# EAGLE schematic defcon2023_v1 (EAGLE 9.6.2)
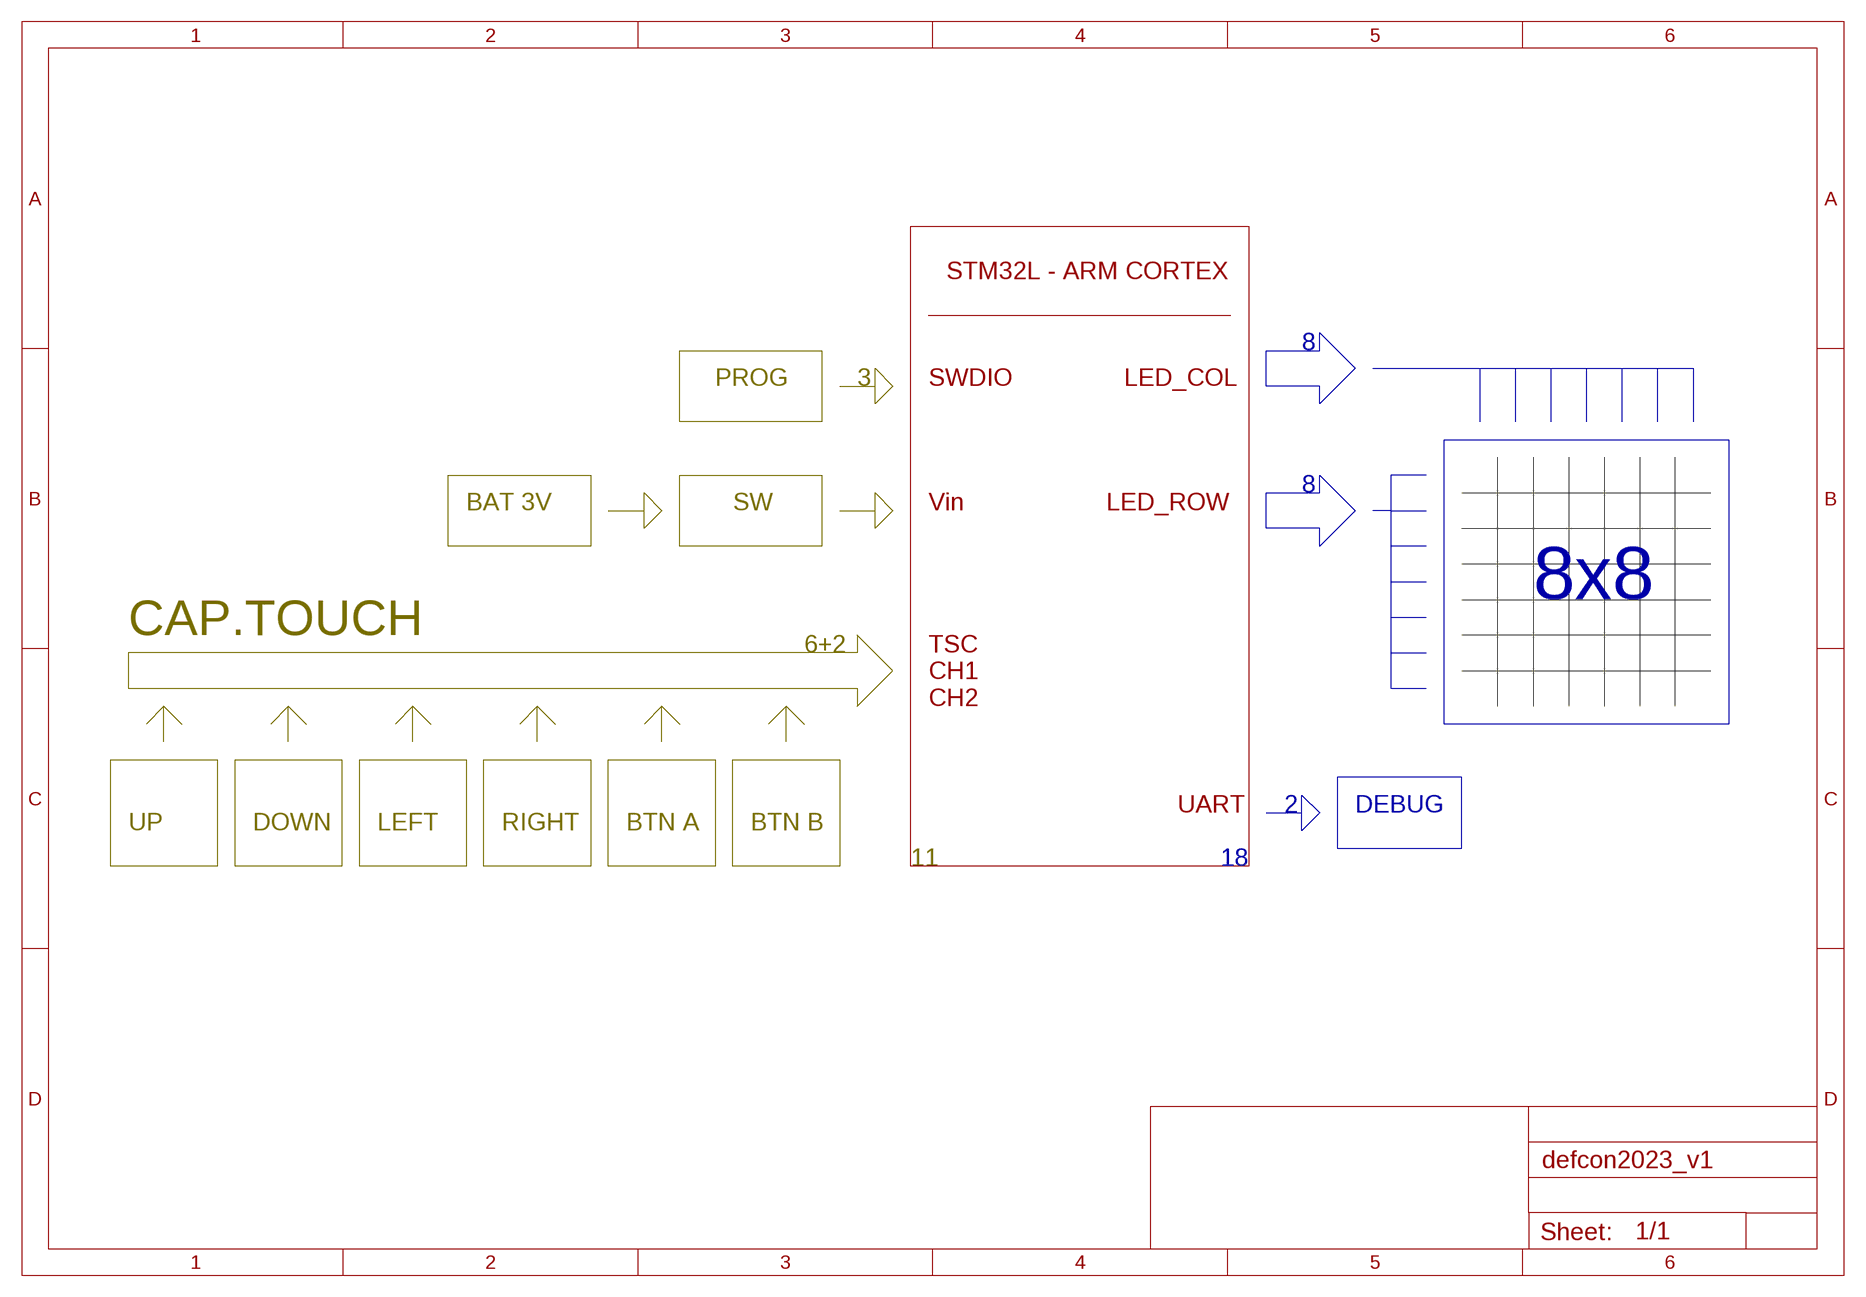
[diagram p0: schematic, sheet 1, part 1 of 2]
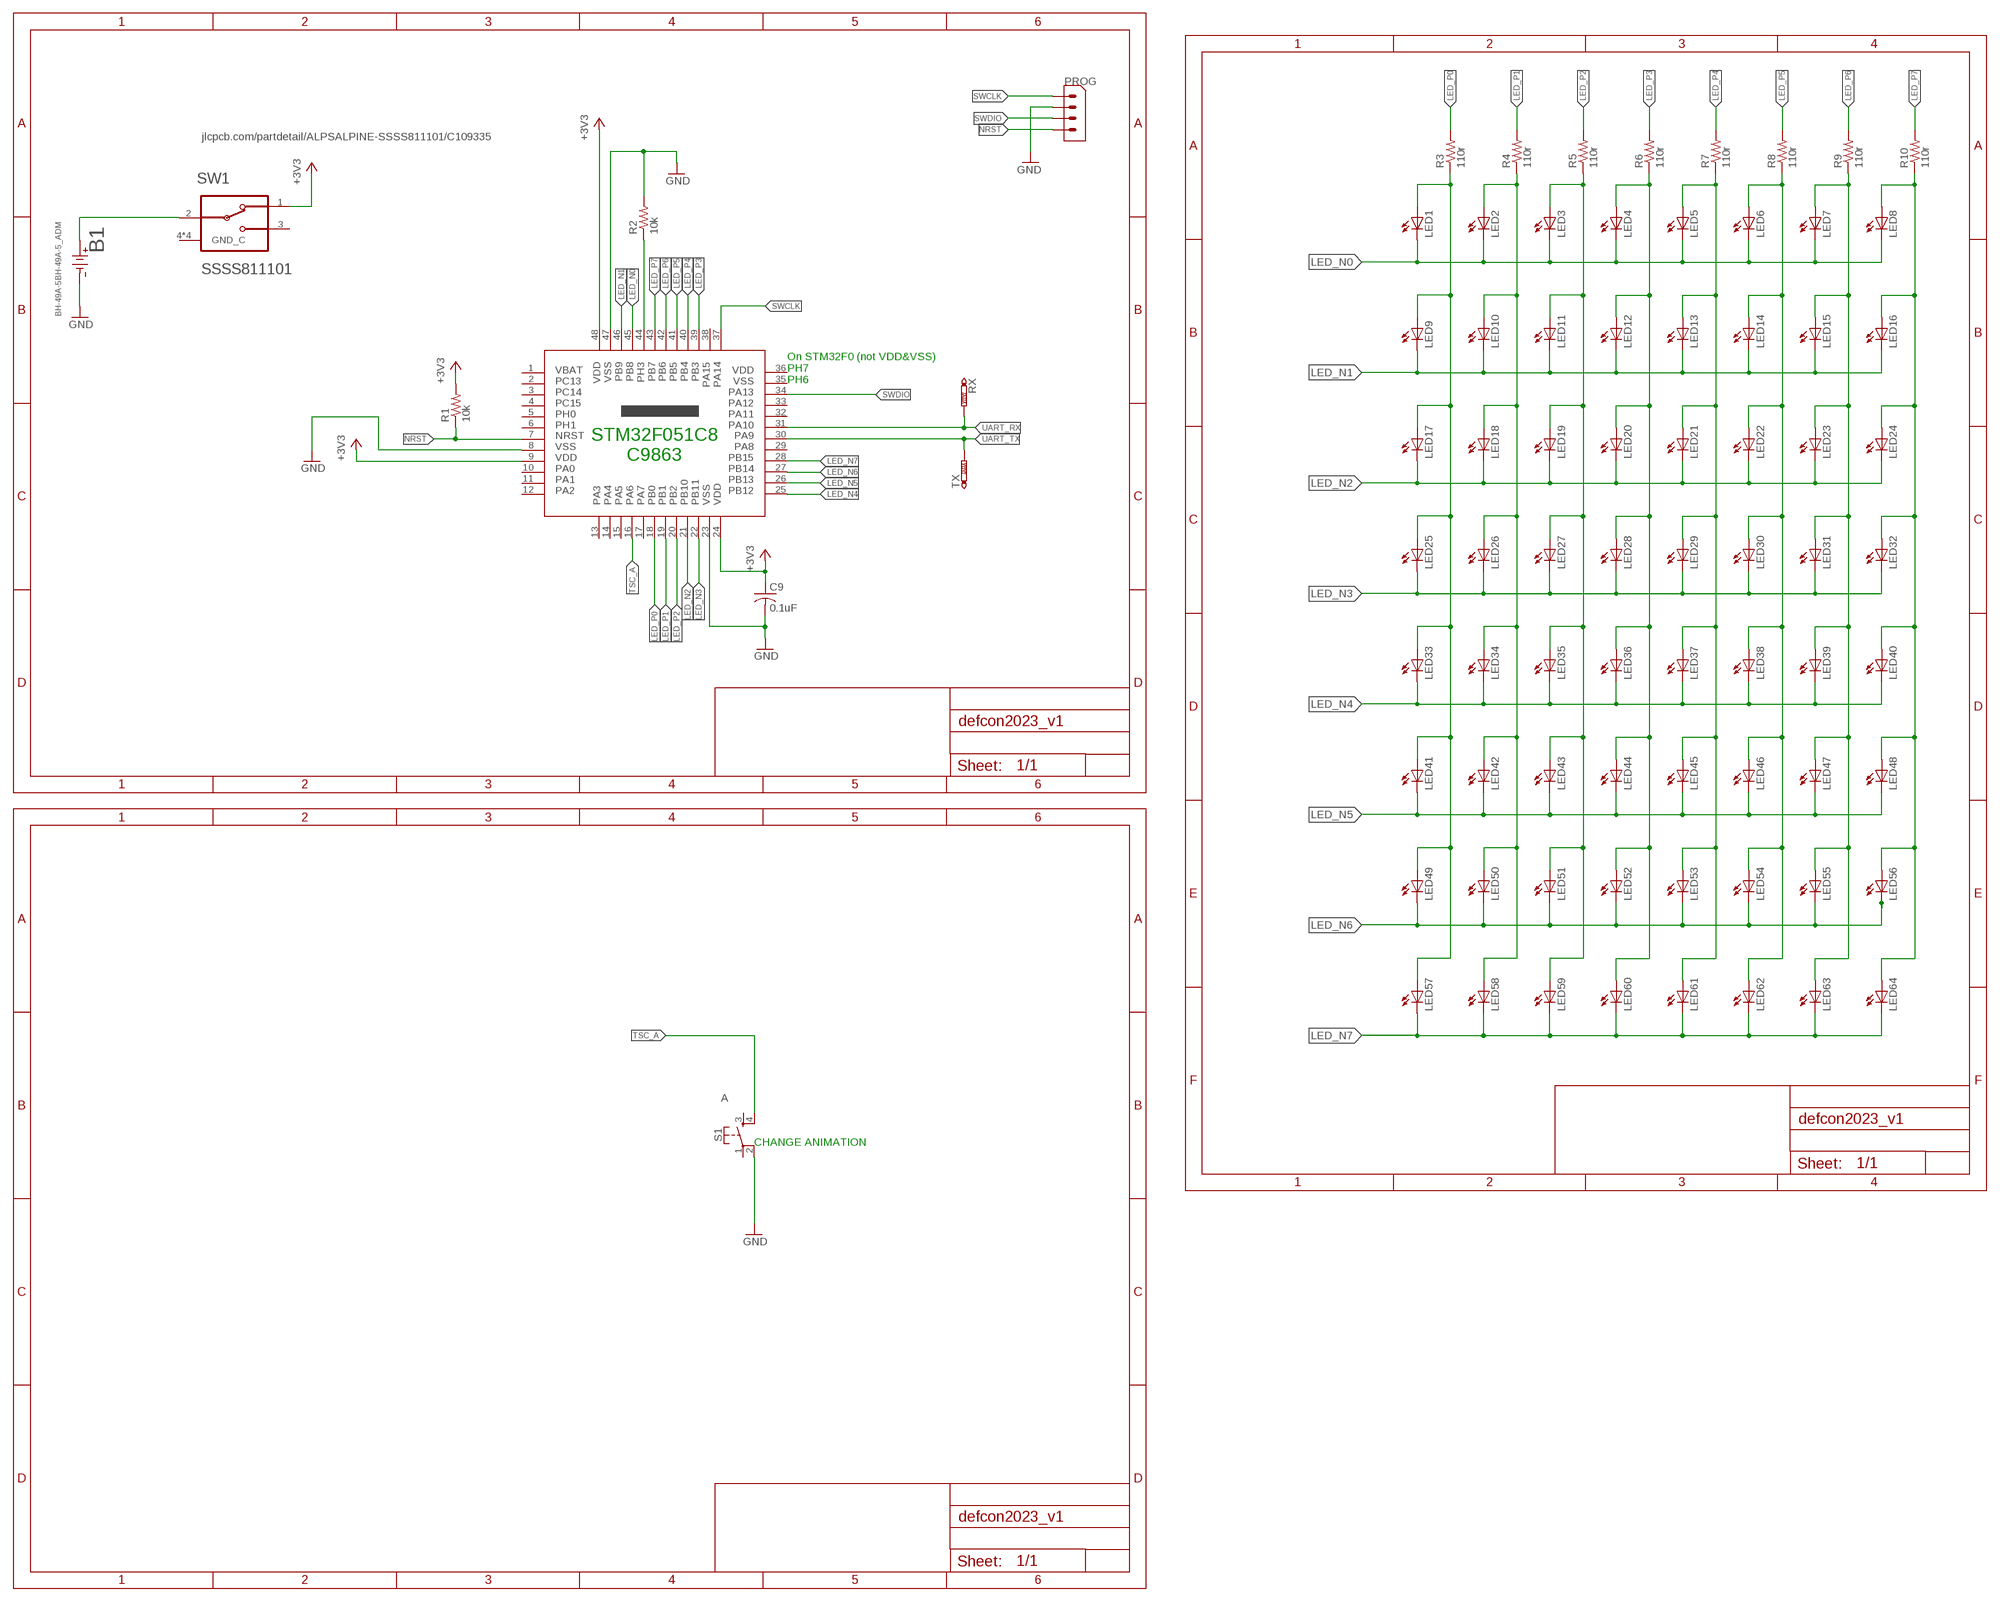
[diagram p1: schematic, sheet 1, part 2 of 2]

## Parts
B1  BH-49A-5BH-49A-5_ADM  [BH-49A-5_ADM]
C9  0.1uF  C-USC0603  [C0603]
LED1  LEDCHIP-LED0603  [CHIP-LED0603]
LED2  LEDCHIP-LED0603  [CHIP-LED0603]
LED3  LEDCHIP-LED0603  [CHIP-LED0603]
LED4  LEDCHIP-LED0603  [CHIP-LED0603]
LED5  LEDCHIP-LED0603  [CHIP-LED0603]
LED6  LEDCHIP-LED0603  [CHIP-LED0603]
LED7  LEDCHIP-LED0603  [CHIP-LED0603]
LED8  LEDCHIP-LED0603  [CHIP-LED0603]
LED9  LEDCHIP-LED0603  [CHIP-LED0603]
LED10  LEDCHIP-LED0603  [CHIP-LED0603]
LED11  LEDCHIP-LED0603  [CHIP-LED0603]
LED12  LEDCHIP-LED0603  [CHIP-LED0603]
LED13  LEDCHIP-LED0603  [CHIP-LED0603]
LED14  LEDCHIP-LED0603  [CHIP-LED0603]
LED15  LEDCHIP-LED0603  [CHIP-LED0603]
LED16  LEDCHIP-LED0603  [CHIP-LED0603]
LED17  LEDCHIP-LED0603  [CHIP-LED0603]
LED18  LEDCHIP-LED0603  [CHIP-LED0603]
LED19  LEDCHIP-LED0603  [CHIP-LED0603]
LED20  LEDCHIP-LED0603  [CHIP-LED0603]
LED21  LEDCHIP-LED0603  [CHIP-LED0603]
LED22  LEDCHIP-LED0603  [CHIP-LED0603]
LED23  LEDCHIP-LED0603  [CHIP-LED0603]
LED24  LEDCHIP-LED0603  [CHIP-LED0603]
LED25  LEDCHIP-LED0603  [CHIP-LED0603]
LED26  LEDCHIP-LED0603  [CHIP-LED0603]
LED27  LEDCHIP-LED0603  [CHIP-LED0603]
LED28  LEDCHIP-LED0603  [CHIP-LED0603]
LED29  LEDCHIP-LED0603  [CHIP-LED0603]
LED30  LEDCHIP-LED0603  [CHIP-LED0603]
LED31  LEDCHIP-LED0603  [CHIP-LED0603]
LED32  LEDCHIP-LED0603  [CHIP-LED0603]
LED33  LEDCHIP-LED0603  [CHIP-LED0603]
LED34  LEDCHIP-LED0603  [CHIP-LED0603]
LED35  LEDCHIP-LED0603  [CHIP-LED0603]
LED36  LEDCHIP-LED0603  [CHIP-LED0603]
LED37  LEDCHIP-LED0603  [CHIP-LED0603]
LED38  LEDCHIP-LED0603  [CHIP-LED0603]
LED39  LEDCHIP-LED0603  [CHIP-LED0603]
LED40  LEDCHIP-LED0603  [CHIP-LED0603]
LED41  LEDCHIP-LED0603  [CHIP-LED0603]
LED42  LEDCHIP-LED0603  [CHIP-LED0603]
LED43  LEDCHIP-LED0603  [CHIP-LED0603]
LED44  LEDCHIP-LED0603  [CHIP-LED0603]
LED45  LEDCHIP-LED0603  [CHIP-LED0603]
LED46  LEDCHIP-LED0603  [CHIP-LED0603]
LED47  LEDCHIP-LED0603  [CHIP-LED0603]
LED48  LEDCHIP-LED0603  [CHIP-LED0603]
LED49  LEDCHIP-LED0603  [CHIP-LED0603]
LED50  LEDCHIP-LED0603  [CHIP-LED0603]
LED51  LEDCHIP-LED0603  [CHIP-LED0603]
LED52  LEDCHIP-LED0603  [CHIP-LED0603]
LED53  LEDCHIP-LED0603  [CHIP-LED0603]
LED54  LEDCHIP-LED0603  [CHIP-LED0603]
LED55  LEDCHIP-LED0603  [CHIP-LED0603]
LED56  LEDCHIP-LED0603  [CHIP-LED0603]
LED57  LEDCHIP-LED0603  [CHIP-LED0603]
LED58  LEDCHIP-LED0603  [CHIP-LED0603]
LED59  LEDCHIP-LED0603  [CHIP-LED0603]
LED60  LEDCHIP-LED0603  [CHIP-LED0603]
LED61  LEDCHIP-LED0603  [CHIP-LED0603]
LED62  LEDCHIP-LED0603  [CHIP-LED0603]
LED63  LEDCHIP-LED0603  [CHIP-LED0603]
LED64  LEDCHIP-LED0603  [CHIP-LED0603]
PROG  4-PIN-1.25MM  [4-PIN-1.25MM]
R1  10k  R-US_R0603  [R0603]
R2  10k  R-US_R0603  [R0603]
R3  110r  R-US_R0603  [R0603]
R4  110r  R-US_R0603  [R0603]
R5  110r  R-US_R0603  [R0603]
R6  110r  R-US_R0603  [R0603]
R7  110r  R-US_R0603  [R0603]
R8  110r  R-US_R0603  [R0603]
R9  110r  R-US_R0603  [R0603]
R10  110r  R-US_R0603  [R0603]
RX  PTR1B1,27  [B1,27]
S1  MOMENTARY-SWITCH-SPST-2-SMD-5.2MM  [TACTILE_SWITCH_SMD_5.2MM]
SW1  ALPS_SSSS811101ALPS_SSSS811101_0_0  [ALPS_SSSS811101_0]
TX  PTR1B1,27  [B1,27]
U$2  STM32L431CC  [QFP50P900X900X160-48]

## Nets
+3V3: C9.1 R1.2 SW1.1 U$2.9 U$2.24 U$2.48
GND: B1.2 C9.2 PROG.P$3 R2.2 S1.2 U$2.8 U$2.23 U$2.47
LED_N0: LED1.C LED2.C LED3.C LED4.C LED5.C LED6.C LED7.C LED8.C U$2.45
LED_N1: LED9.C LED10.C LED11.C LED12.C LED13.C LED14.C LED15.C LED16.C U$2.46
LED_N2: LED17.C LED18.C LED19.C LED20.C LED21.C LED22.C LED23.C LED24.C U$2.21
LED_N3: LED25.C LED26.C LED27.C LED28.C LED29.C LED30.C LED31.C LED32.C U$2.22
LED_N4: LED33.C LED34.C LED35.C LED36.C LED37.C LED38.C LED39.C LED40.C U$2.25
LED_N5: LED41.C LED42.C LED43.C LED44.C LED45.C LED46.C LED47.C LED48.C U$2.26
LED_N6: LED49.C LED50.C LED51.C LED52.C LED53.C LED54.C LED55.C LED56.C U$2.27
LED_N7: LED57.C LED58.C LED59.C LED60.C LED61.C LED62.C LED63.C LED64.C U$2.28
LED_P0: R3.2 U$2.18
LED_P0B: LED1.A LED9.A LED17.A LED25.A LED33.A LED41.A LED49.A LED57.A R3.1
LED_P1: R4.2 U$2.19
LED_P1B: LED2.A LED10.A LED18.A LED26.A LED34.A LED42.A LED50.A LED58.A R4.1
LED_P2: R5.2 U$2.20
LED_P2B: LED3.A LED11.A LED19.A LED27.A LED35.A LED43.A LED51.A LED59.A R5.1
LED_P3: R6.2 U$2.39
LED_P3B: LED4.A LED12.A LED20.A LED28.A LED36.A LED44.A LED52.A LED60.A R6.1
LED_P4: R7.2 U$2.40
LED_P4B: LED5.A LED13.A LED21.A LED29.A LED37.A LED45.A LED53.A LED61.A R7.1
LED_P5: R8.2 U$2.41
LED_P5B: LED6.A LED14.A LED22.A LED30.A LED38.A LED46.A LED54.A LED62.A R8.1
LED_P6: R9.2 U$2.42
LED_P6B: LED7.A LED15.A LED23.A LED31.A LED39.A LED47.A LED55.A LED63.A R9.1
LED_P7: R10.2 U$2.43
LED_P7B: LED8.A LED16.A LED24.A LED32.A LED40.A LED48.A LED56.A LED64.A R10.1
N$6: R2.1 U$2.44
N$14: B1.1 SW1.2(C)
NRST: PROG.P$1 R1.1 U$2.7
SWCLK: PROG.P$4 U$2.37
SWDIO: PROG.P$2 U$2.34
TSC_A: S1.4 U$2.16
UART_RX: RX.TP U$2.31
UART_TX: TX.TP U$2.30
Unconnected: S1.1 S1.3 SW1.3 SW1.4(GND_C) SW1.4-2(GND_C) SW1.4-3(GND_C) SW1.4-4(GND_C) U$2.1 U$2.2 U$2.3 U$2.4 U$2.5 U$2.6 U$2.10 U$2.11 U$2.12 U$2.13 U$2.14 U$2.15 U$2.17 U$2.29 U$2.32 U$2.33 U$2.35 U$2.36 U$2.38

## Buses
B$1
B$2
B$3
B$4
B$5
B$7
B$6
B$8

## Notes on the sheet
- jlcpcb.com/partdetail/ALPSALPINE-SSSS811101/C109335
- STM32L - ARM CORTEX
- 8
- PROG | 3 | SWDIO | LED_COL
- 8
- BAT 3V | SW | Vin | LED_ROW
- 8x8
- On STM32F0 (not VDD&VSS)
  PH7
  PH6
- CAP.TOUCH
- 6+2
- TSC 
  CH1
  CH2
- STM32F051C8
  C9863
- UART | 2 | DEBUG
- UP | DOWN | LEFT | RIGHT | BTN A | BTN B
- 11 | 18
- A
- CHANGE ANIMATION

## Library data of the parts
B1 = 2057-BH-49A-5-ND:BH-49A-5; COPYRIGHT: Copyright (C) 2023 Ultra Librarian. All rights reserved.; DIGI-KEY_PART_NUMBER_1: 2057-BH-49A-5-ND; MANUFACTURER_PART_NUMBER: BH-49A-5; MFR_NAME: ADAM TECHNOLOGIES INC
C9 = rcl:C-US: CAPACITOR, American symbol; SPICEPREFIX: C
LED1-LED64 = adafruit:LED: LED OSRAM: - CHIPLED LG R971, LG N971, LY N971, LG Q971, LY Q971, LO R971, LY R971 LH N974, LH R974 LS Q976, LO Q976, LY Q976 LO Q996 - Hyper CHIPLED LW Q18S LB Q993, LB Q99A, LB R99A - SideLED LS A670, LO A670, LY A670, LG A670, LP A670 LB A673, LV A673, LT A673, LW A673 LH A674 LY A675 LS A676, LA A676, LO A676, LY A676, LW A676 LS A679, LY A679, LG A679 - Hyper Micro SIDELED® LS Y876, LA Y876, LO Y876, LY Y876 LT Y87S - SmartLED LW L88C, LW L88S LB L89C, LB L89S, LG L890 LS L89K, LO L89K, LY L89K LS L896, LA L896, LO L896, LY L896 - TOPLED LS T670, LO T670, LY T670, LG T670, LP T670 LSG T670, LSP T670, LSY T670, LOP T670, LYG T670 LG T671, LOG T671, LSG T671 LB T673, LV T673, LT T673, LW T673 LH T674 LS T676, LA T676, LO T676, LY T676, LB T676, LH T676, LSB T676, LW T676 LB T67C, LV T67C, LT T67C, LS T67K, LO T67K, LY T67K, LW E67C LS E67B, LA E67B, LO E67B, LY E67B, LB E67C, LV E67C, LT E67C LW T67C LS T679, LY T679, LG T679 LS T770, LO T770, LY T770, LG T770, LP T770 LB T773, LV T773, LT T773, LW T773 LH T774 LS E675, LA E675, LY E675, LS T675 LS T776, LA T776, LO T776, LY T776, LB T776 LHGB T686 LT T68C, LB T68C - Hyper Mini TOPLED® LB M676 - Mini TOPLED Santana® LG M470 LS M47K, LO M47K, LY M47K Source: http://www.osram.convergy.de/
PROG = Wingling Library:4-PIN-1.25MM
R1-R10 = rcl:R-US_: RESISTOR, American symbol; SPICEPREFIX: R
RX TX = testpad:PTR1: TEST PIN
S1 = SparkFun-Switches:MOMENTARY-SWITCH-SPST-2: Momentary Switch (Pushbutton) - SPST - Two Circuits Normally-open (NO) SPST momentary switches (buttons, pushbuttons). Schematic symbol includes two switch circuits. Variants SMD-4.6MMX2.8MM - 4.60mm x 2.80mm Tactile Momentary Button Switch - Used on SparkFun SAMD21 Mini Breakout <https://www.sparkfun.com/products/13664> SMD-5.2MM - Mini Pushbutton Switch - SMD <https://www.sparkfun.com/products/8720> - Used on Arduino Pro Mini <https://www.sparkfun.com/products/11114>; PROD_ID: SWCH-08247; SF_SKU: COM-08720
SW1 = ALPS - SSSS811101:ALPS_SSSS811101: 1.4(H)mm, 1.5/2.0mm-travel Surface Mount Type; CENTROID_NOT_SPECIFIED: No; CONTACT_RESISTANCE: 70mΩ; DATASHEET: http://www.alps.com/prod/info/E/HTML/Switch/Slide/SSSS8/SSSS811101.html; LEAD_FREE: yes; MF: ALPS; MOUSER_PART_NUMBER: 688-SSSS811101; MPN: SSSS811101; PACKAGE: SMD_SW_SPDT; PREFIX: SW; RATING_(MAX.)/(MIN.)_(RESISTIVE_LOAD): 0.3A 5V DC/50µA 3V DC; ROHS: yes; TEMPERATURE_RANGE_HIGH: +85°C; TEMPERATURE_RANGE_LOW: -40°C
U$2 = prankbox:STM32L431CC